# EAGLE design waveform shield (EAGLE 7.5.0)
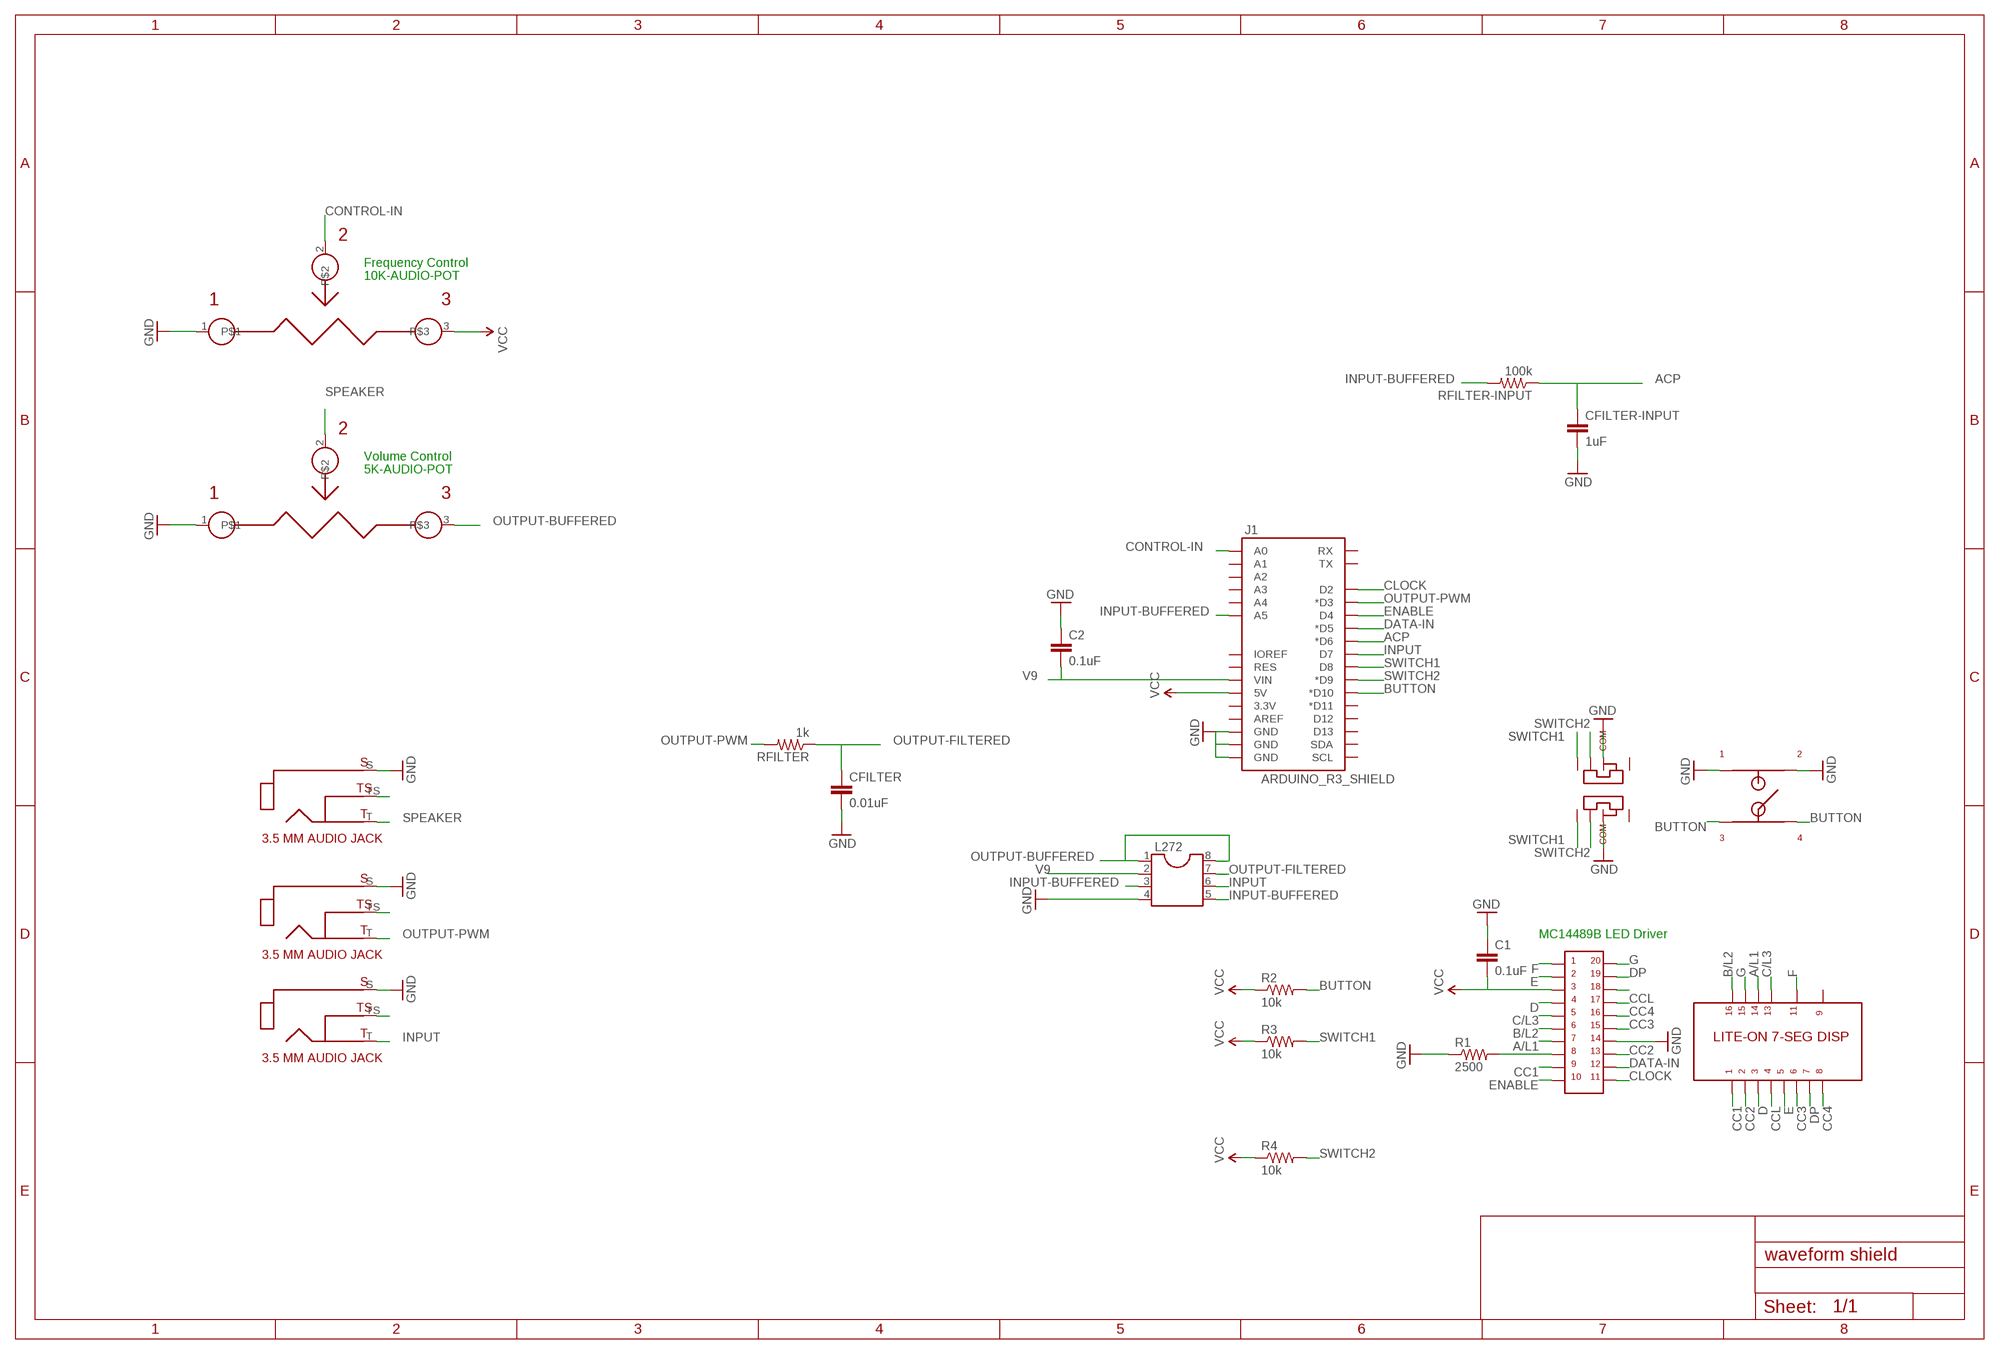
[diagram p0: schematic, sheet 1]

## Parts
5K-AUDIO-POT  BOURNS-PTV09A-2  [BOURNS-POT-PTV09A-2]
C1  0.1uF  CAPPTH  [CAP-PTH-SMALL]
C2  0.1uF  CAPPTH  [CAP-PTH-SMALL]
CFILTER  0.01uF  CAPPTH  [CAP-PTH-SMALL]
CFILTER-INPUT  1uF  CAPPTH  [CAP-PTH-SMALL]
J1  ARDUINO_R3_SHIELD  [UNO_R3_SHIELD]
L272  DIL8  [DIL08]
R1  2500  RESISTORAXIAL-0.3  [AXIAL-0.3]
R2  10k  RESISTORAXIAL-0.3  [AXIAL-0.3]
R3  10k  RESISTORAXIAL-0.3  [AXIAL-0.3]
R4  10k  RESISTORAXIAL-0.3  [AXIAL-0.3]
RFILTER  1k  RESISTORAXIAL-0.3  [AXIAL-0.3]
RFILTER-INPUT  100k  RESISTORAXIAL-0.3  [AXIAL-0.3]
U$1  LITE-ON-7-SEG-DISP  [7-SEG-DISPLAY-LITE-ON]
U$2  MC14489B-LED-DRIVER  [DIP-20]
U$3  3.5MM-AUDIO-JACK-CUI  [3.5MM-AUDIO-JACK-MONO-CUI]
U$4  E-SWITCH-THREE-WAY-SWITCH  [EG2301-SLIDE-SWITCH]
U$5  SWITCH-MOMENTARY-ON-SCHURTER  [SWITCH-MOMENTARY-ON-SCHURTER]
U$6  3.5MM-AUDIO-JACK-CUI  [3.5MM-AUDIO-JACK-MONO-CUI]
U$7  3.5MM-AUDIO-JACK-CUI  [3.5MM-AUDIO-JACK-MONO-CUI]
U$9  BOURNS-PTV09A-2  [BOURNS-POT-PTV09A-2]

## Nets
A/L1: U$1.P$14 U$2.P$7
ACP: CFILTER-INPUT.1 J1.D6(*D6) RFILTER-INPUT.P$1
B/L2: U$1.P$16 U$2.P$6
BUTTON: J1.D10(*D10) R2.P$2 U$5.P$3 U$5.P$4
C/L3: U$1.P$13 U$2.P$5
CC1: U$1.P$1 U$2.P$9
CC2: U$1.P$2 U$2.P$13
CC3: U$1.P$6 U$2.P$15
CC4: U$1.P$8 U$2.P$16
CCL: U$1.P$4 U$2.P$17
CLOCK: J1.D2 U$2.P$11
CONTROL-IN: J1.A0 U$9.2
D: U$1.P$3 U$2.P$4
DATA-IN: J1.D5(*D5) U$2.P$12
DP: U$1.P$7 U$2.P$19
E: U$1.P$5 U$2.P$2
ENABLE: J1.D4 U$2.P$10
F: U$1.P$11 U$2.P$1
G: U$1.P$15 U$2.P$20
GND: 5K-AUDIO-POT.1 C1.1 C2.1 CFILTER-INPUT.2 CFILTER.2 J1.GND@0(GND) J1.GND@1(GND) J1.GND@2(GND) L272.4 R1.P$1 U$2.P$14 U$3.S U$4.P$3 U$4.P$7 U$5.P$1 U$5.P$2 U$6.S U$7.S U$9.1
INPUT: J1.D7 L272.6 U$7.T
INPUT-BUFFERED: J1.A5 L272.3 L272.5 RFILTER-INPUT.P$2
N$2: U$3.TS
N$3: R1.P$2 U$2.P$8
N$10: U$6.TS
N$13: U$7.TS
N$18: U$2.P$18
OUTPUT-BUFFERED: 5K-AUDIO-POT.3 L272.1 L272.8
OUTPUT-FILTERED: CFILTER.1 L272.7 RFILTER.P$1
OUTPUT-PWM: J1.D3(*D3) RFILTER.P$2 U$6.T
SPEAKER: 5K-AUDIO-POT.2 U$3.T
SWITCH1: J1.D8 R3.P$2 U$4.P$1 U$4.P$5
SWITCH2: J1.D9(*D9) R4.P$2 U$4.P$2 U$4.P$6
V9: C2.2 J1.VIN L272.2
VCC: C1.2 J1.5V R2.P$1 R3.P$1 R4.P$1 U$2.P$3 U$9.3
Unconnected: J1.3.3V J1.A1 J1.A2 J1.A3 J1.A4 J1.AREF J1.D11(*D11) J1.D12 J1.D13 J1.IOREF J1.RES J1.RX J1.SCL J1.SDA J1.TX U$1.P$9 U$4.P$4 U$4.P$8

## Notes on the sheet
- Frequency Control
- 10K-AUDIO-POT
- Volume Control
- 5K-AUDIO-POT
- MC14489B LED Driver

## Library data of the parts
5K-AUDIO-POT U$9 = groff:BOURNS-PTV09A-2
C1 C2 CFILTER CFILTER-INPUT = SparkFun-Capacitors:CAP: Capacitor Standard 0603 ceramic capacitor, and 0.1" leaded capacitor.
J1 = groff:ARDUINO_R3_SHIELD: Shield form compatible with the Arduino Uno R3.
L272 = ic-package:DIL8: Dual In Line / Socket
R1 = SparkFun-Passives:RESISTOR: Resistor Basic schematic elements and footprints for 0603, 1206, and PTH resistors.
R2-R4 RFILTER RFILTER-INPUT = SparkFun-Resistors:RESISTOR: Resistor Basic schematic elements and footprints for 0603, 1206, and PTH resistors.
U$1 = groff:LITE-ON-7-SEG-DISP
U$2 = groff:MC14489B-LED-DRIVER: MC14489B LED Driver Motorola/Freescale
U$3 U$6 U$7 = groff:3.5MM-AUDIO-JACK-CUI
U$4 = groff:E-SWITCH-THREE-WAY-SWITCH
U$5 = groff:SWITCH-MOMENTARY-ON-SCHURTER

## Board
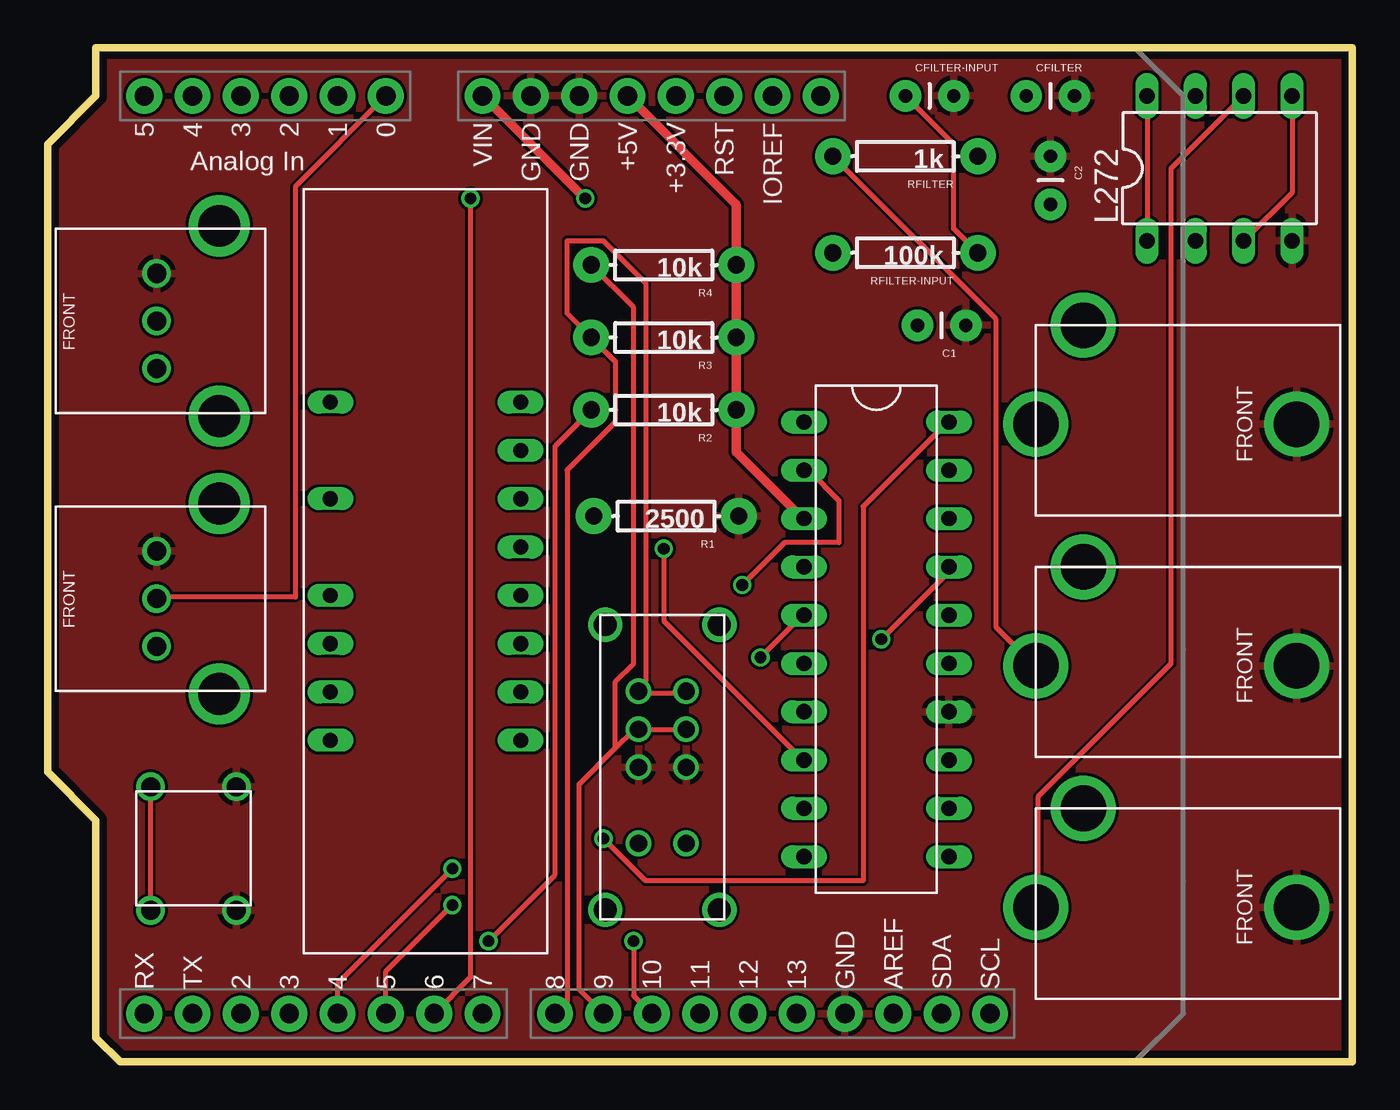
[diagram p1: board, top side]
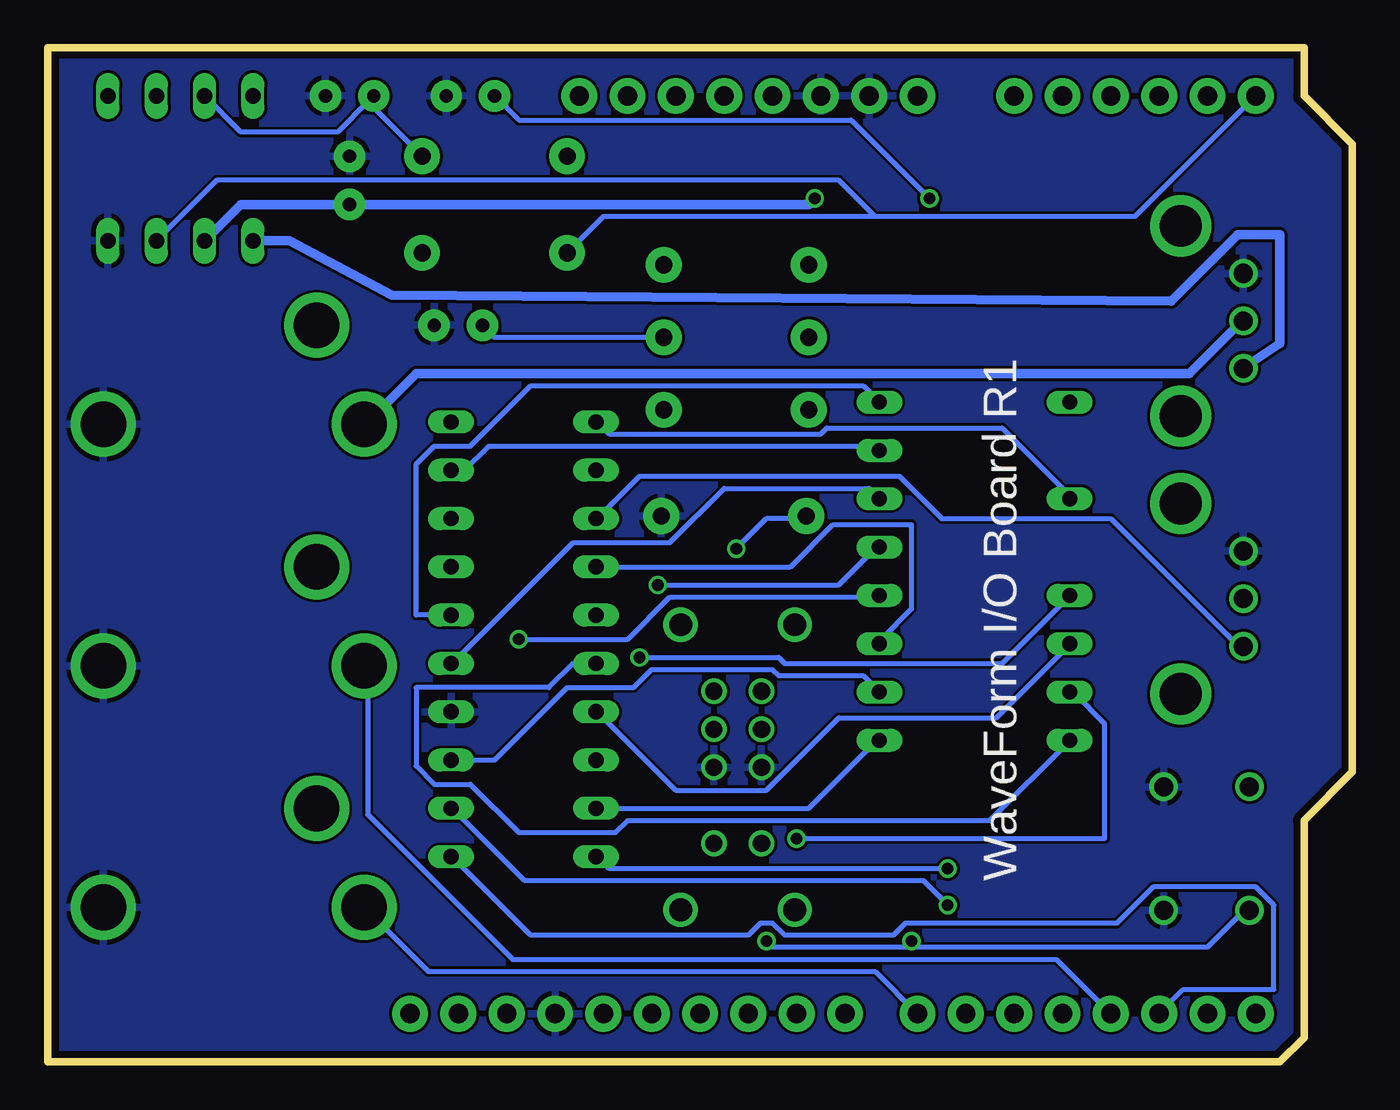
[diagram p2: board, bottom side, seen from below]

Size 68.58 x 53.34 mm. Coordinates in mm from the lower left corner, seen from the top.
Outline: 2.54,53.34 2.54,50.8 0,48.26 0,15.24 2.54,12.7 2.54,1.27 3.81,0 68.58,0 68.58,53.34 2.54,53.34
Copper layers (1*16): Top 0.0356mm / dielectric 1.5011mm / Bottom 0.0356mm
Design rules "LaenPCBOrder": minimum track width 6mil, minimum drill 13mil, track to track 6mil, track to pad 6mil, pad to pad 6mil, via to via 6mil, smd to smd 6mil, copper to edge 15mil, drill to drill 6mil, minimum pad ring 7mil, minimum via ring 7mil, stop-mask expansion 3mil, vias tented up to drill 0mil, thermal gap 10mil

### Footprints (pad centres in the part's own frame; a part is rotated, then mirrored left to right if it is on the bottom)
BOURNS-POT-PTV09A-2 = drill 1: 1 5.7,2.35; 2 5.7,4.85; 3 5.7,7.35 | drill 2.2: P$4 2.4,9.85; P$5 2.4,-0.15
CAP-PTH-SMALL = drill 0.7 pad 1.651: 1 0,0; 2 2.54,0
UNO_R3_SHIELD = drill 1.016 pad 1.88: 3.3V 50.8,26.67; 5V 50.8,29.21; A0 50.8,41.91; A1 50.8,44.45; A2 50.8,46.99; A3 50.8,49.53; A4 50.8,52.07; A5 50.8,54.61; AREF 2.54,15.24; D2 2.54,49.53; D3 2.54,46.99; D4 2.54,44.45; D5 2.54,41.91; D6 2.54,39.37; D7 2.54,36.83; D8 2.54,33.02; D9 2.54,30.48; D10 2.54,27.94; D11 2.54,25.4; D12 2.54,22.86; D13 2.54,20.32; GND@0 50.8,31.75; GND@1 50.8,34.29; GND@2 2.54,17.78; IOREF 50.8,21.59; NC 50.8,19.05; RES 50.8,24.13; RX 2.54,54.61; SCL 2.54,10.16; SDA 2.54,12.7; TX 2.54,52.07; VIN 50.8,36.83
DIL08 = drill 0.813 long: 1 -3.81,-3.81; 2 -1.27,-3.81; 3 1.27,-3.81; 4 3.81,-3.81; 5 3.81,3.81; 6 1.27,3.81; 7 -1.27,3.81; 8 -3.81,3.81
AXIAL-0.3 = drill 0.9 pad 1.88: P$1 -3.81,0; P$2 3.81,0
7-SEG-DISPLAY-LITE-ON = drill 0.8 long: P$1 11.2,-11.4; P$2 13.74,-11.4; P$3 16.28,-11.4; P$4 18.82,-11.4; P$5 21.36,-11.4; P$6 23.9,-11.4; P$7 26.44,-11.4; P$8 28.98,-11.4; P$9 28.98,-1.4; P$11 23.9,-1.4; P$13 18.82,-1.4; P$14 16.28,-1.4; P$15 13.74,-1.4; P$16 11.2,-1.4
DIP-20 = drill 0.8 long: P$1 1.905,-6.985; P$2 4.445,-6.985; P$3 6.985,-6.985; P$4 9.525,-6.985; P$5 12.065,-6.985; P$6 14.605,-6.985; P$7 17.145,-6.985; P$8 19.685,-6.985; P$9 22.225,-6.985; P$10 24.765,-6.985; P$11 24.765,0.635; P$12 22.225,0.635; P$13 19.685,0.635; P$14 17.145,0.635; P$15 14.605,0.635; P$16 12.065,0.635; P$17 9.525,0.635; P$18 6.985,0.635; P$19 4.445,0.635; P$20 1.905,0.635
3.5MM-AUDIO-JACK-MONO-CUI = drill 2.4: S 2.3,5.2; T 16,5.2; TS 13.5,0
EG2301-SLIDE-SWITCH = drill 0.9: P$1 4,-4.5; P$2 6,-4.5; P$3 8,-4.5; P$4 12,-4.5; P$5 4,-2; P$6 6,-2; P$7 8,-2; P$8 12,-2 | drill 1.2: P$9 0.5,-6.25; P$10 15.5,-6.25; P$11 15.5,-0.25; P$12 0.5,-0.25
SWITCH-MOMENTARY-ON-SCHURTER = drill 1: P$1 -0.25,-0.75; P$2 6.25,-0.75; P$3 -0.25,-5.25; P$4 6.25,-5.25

### Placement (x,y rotation side)
5K-AUDIO-POT  11.43,43.81 180 top
C1  48.26,38.73 180 top
C2  52.7,47.62 270 top
CFILTER  51.44,50.8 0 top
CFILTER-INPUT  45.09,50.8 0 top
J1  59.69,0 90 top
L272  61.59,46.99 0 top
R1  32.51,28.7 180 top
R2  32.38,34.29 180 top
R3  32.38,38.1 180 top
R4  32.38,41.91 180 top
RFILTER  45.09,47.62 180 top
RFILTER-INPUT  45.09,42.55 180 top
U$1  13.46,5.71 90 top
U$2  46.74,35.56 270 top
U$3  67.94,38.73 180 top
U$4  35.56,23.5 270 top
U$5  10.67,14.22 270 top
U$6  67.94,26.04 180 top
U$7  67.94,13.34 180 top
U$9  11.43,29.21 180 top

### Tracks (layer width: path | path; a pad name or v marks a point on that pad's centre or on a via)
A/L1
  Bottom 0.254: U$1.P$14 14.92,21.91 18.73,18.1 26.99,18.1 30.8,14.29 35.56,14.29 39.69,18.41 U$2.P$7
ACP  (via drill 0.61)
  Top 0.254: CFILTER-INPUT.1 47.62,48.26 47.62,43.81 RFILTER-INPUT.P$1 | J1.D6 22.23,4.45 v22.23,45.4
  Bottom 0.254: v22.23,45.4 26.35,49.53 43.81,49.53 CFILTER-INPUT.1
B/L2
  Bottom 0.254: U$2.P$6 40.96,20.95 42.23,19.68 49.21,19.68 49.21,15.56 48.26,14.61 46.35,14.61 43.81,12.06 38.73,12.06 38.1,12.7 19.05,12.7 14.92,16.83 U$1.P$16
BUTTON  (via drill 0.61)
  Top 0.254: U$5.P$4 5.4,8.26 5.4,14.29 U$5.P$3 | J1.D10 30.8,3.49 v30.8,6.35 | R2.P$2 26.67,32.38 26.67,9.84 v23.18,6.35
  Bottom 0.254: v30.8,6.35 30.48,6.03 23.18,6.03 | 23.18,6.03 7.62,6.03 5.71,7.94 U$5.P$4 | 23.18,6.03 v23.18,6.35
C/L3  (via drill 0.61)
  Top 0.254: v37.47,21.27 39.69,23.5 U$2.P$5
  Bottom 0.254: v37.47,21.27 30.16,21.27 29.84,20.95 18.41,20.95 14.92,24.45 U$1.P$13
CC1
  Bottom 0.254: U$2.P$9 28.57,13.34 25.08,16.83 U$1.P$1
CC2
  Bottom 0.254: U$2.P$13 45.09,15.88 41.27,19.68 37.78,19.68 36.83,20.64 30.48,20.64 30.16,20.32 25.72,20.32 25.08,19.68 U$1.P$2
CC3
  Bottom 0.254: U$1.P$6 25.08,29.84 25.4,30.16 33.02,30.16 35.88,27.3 40.96,27.3 47.31,20.95 U$2.P$15
CC4
  Bottom 0.254: U$2.P$16 49.21,23.5 49.21,31.43 48.26,32.38 46.35,32.38 43.18,35.56 25.72,35.56 25.08,34.92 U$1.P$8
CCL  (via drill 0.61)
  Top 0.254: v43.81,22.23 47.31,25.72 47.31,26.04 U$2.P$17
  Bottom 0.254: v43.81,22.23 38.1,22.23 35.88,24.45 25.08,24.45 U$1.P$4
CLOCK
  Bottom 0.254: J1.D2 8.89,3.81 4.13,3.81 4.13,8.26 5.08,9.21 10.48,9.21 12.38,7.3 23.5,7.3 24.13,6.67 29.84,6.67 30.48,7.3 31.11,7.3 31.75,6.67 43.18,6.67 47.31,10.79 U$2.P$11
CONTROL-IN
  Top 0.254: J1.A0 13.02,46.04 13.02,24.45 6.03,24.45 U$9.2
D
  Bottom 0.254: U$2.P$4 29.53,26.04 27.3,28.26 23.18,28.26 23.18,23.81 24.77,22.23 U$1.P$3
DATA-IN  (via drill 0.61)
  Top 0.254: v21.27,8.26 17.78,4.76 J1.D5
  Bottom 0.254: v21.27,8.26 22.54,9.53 43.5,9.53 47.31,13.34 U$2.P$12
DP
  Bottom 0.254: U$2.P$19 46.67,31.11 45.4,32.38 25.08,32.38 U$1.P$7
E  (via drill 0.61)
  Top 0.254: v36.51,25.08 38.73,27.3 41.59,27.3 41.59,29.53 40.01,31.11 U$2.P$2
  Bottom 0.254: v36.51,25.08 26.99,25.08 25.08,26.99 U$1.P$5
ENABLE  (via drill 0.61)
  Top 0.254: v21.27,10.16 15.24,4.13 J1.D4
  Bottom 0.254: v21.27,10.16 39.05,10.16 39.69,10.79 U$2.P$10
F
  Bottom 0.254: U$1.P$11 14.92,29.84 18.41,33.34 27.62,33.34 27.94,33.02 39.05,33.02 39.69,33.66 U$2.P$1
G  (via drill 0.61)
  Top 0.254: v29.21,11.75 31.43,9.53 42.86,9.53 42.86,29.21 47.31,33.66 U$2.P$20
  Bottom 0.254: v29.21,11.75 13.02,11.75 13.02,17.78 14.61,19.37 U$1.P$15
GND
  pour Bottom: 2.54,53.34 2.54,50.8 0,48.26 0,15.24 2.54,12.7 2.54,1.27 3.81,0 68.58,0 68.58,53.34
  pour Top: 2.54,53.34 2.54,50.8 0,48.26 0,15.24 2.54,12.7 2.54,1.27 3.81,0 68.58,0 68.58,53.34
INPUT
  Top 0.254: L272.6 59.05,46.99 59.05,20.95 52.07,13.97 52.07,8.26 U$7.T
  Bottom 0.254: J1.D7 25.08,4.76 48.58,4.76 51.75,7.94 U$7.T
INPUT-BUFFERED
  Top 0.254: L272.3 65.41,45.72 L272.5
  Bottom 0.254: RFILTER-INPUT.P$2 39.37,44.45 25.08,44.45 | 25.08,44.45 11.43,44.45 J1.A5 | L272.3 59.69,46.35 26.99,46.35 25.08,44.45
N$3  (via drill 0.61)
  Top 0.254: v32.38,26.99 32.38,23.18 39.69,15.88 U$2.P$8
  Bottom 0.254: v32.38,26.99 30.8,28.57 28.89,28.57 R1.P$2
OUTPUT-BUFFERED
  Top 0.254: L272.8 L272.1
  Bottom 0.254: 5.71,36.51 5K-AUDIO-POT.3
  Bottom 0.508: 5.71,36.51 3.81,37.78 3.81,43.5 6.03,43.5 9.53,40.01 50.48,40.32 55.88,43.18 L272.1
OUTPUT-FILTERED
  Bottom 0.254: L272.7 58.42,48.9 53.34,48.9 51.75,50.48 | 51.75,50.48 RFILTER.P$1 | 51.75,50.48 CFILTER.1
OUTPUT-PWM
  Top 0.254: RFILTER.P$2 49.85,39.05 49.85,22.86 51.75,20.95 U$6.T
  Bottom 0.254: J1.D3 15.56,5.4 44.13,5.4 51.75,13.02 51.75,20.64 U$6.T
SPEAKER
  Bottom 0.254: 51.75,33.66 U$3.T
  Bottom 0.508: 51.75,33.66 49.21,36.2 8.57,36.2 6.03,38.73 5K-AUDIO-POT.2
SWITCH1
  Top 0.254: U$4.P$5 33.34,19.37 31.11,19.37 U$4.P$1 31.11,19.68 31.43,20 31.43,40.96 29.21,43.18 27.3,43.18 27.3,39.37 R3.P$2 29.84,36.83 29.84,33.66 27.3,31.11 27.3,3.17 J1.D8
SWITCH2
  Top 0.254: U$4.P$6 33.34,17.46 31.11,17.46 U$4.P$2 30.8,17.46 29.84,16.51 | 29.84,16.51 27.94,14.61 27.94,3.81 J1.D9 | R4.P$2 30.8,39.69 30.8,20.95 29.84,20 29.84,16.51
V9  (via drill 0.61)
  Top 0.508: v28.26,45.4 J1.VIN
  Bottom 0.508: L272.2 58.42,45.09 C2.2 28.57,45.09 v28.26,45.4
VCC
  Top 0.254: 39.69,28.57 U$2.P$3
  Top 0.508: J1.5V 36.2,45.09 R4.P$1 R3.P$1 R2.P$1 36.2,32.07 39.69,28.57
  Bottom 0.254: C1.2 45.09,38.1 R3.P$1 | U$9.3 6.03,21.91 12.7,28.57 21.59,28.57 23.81,30.8 37.47,30.8 39.69,28.57 U$2.P$3

### Text on the board
bNames: WaveForm I/O Board R1